# Altium schematic sheet 03-WIFI.SchDoc
size A4
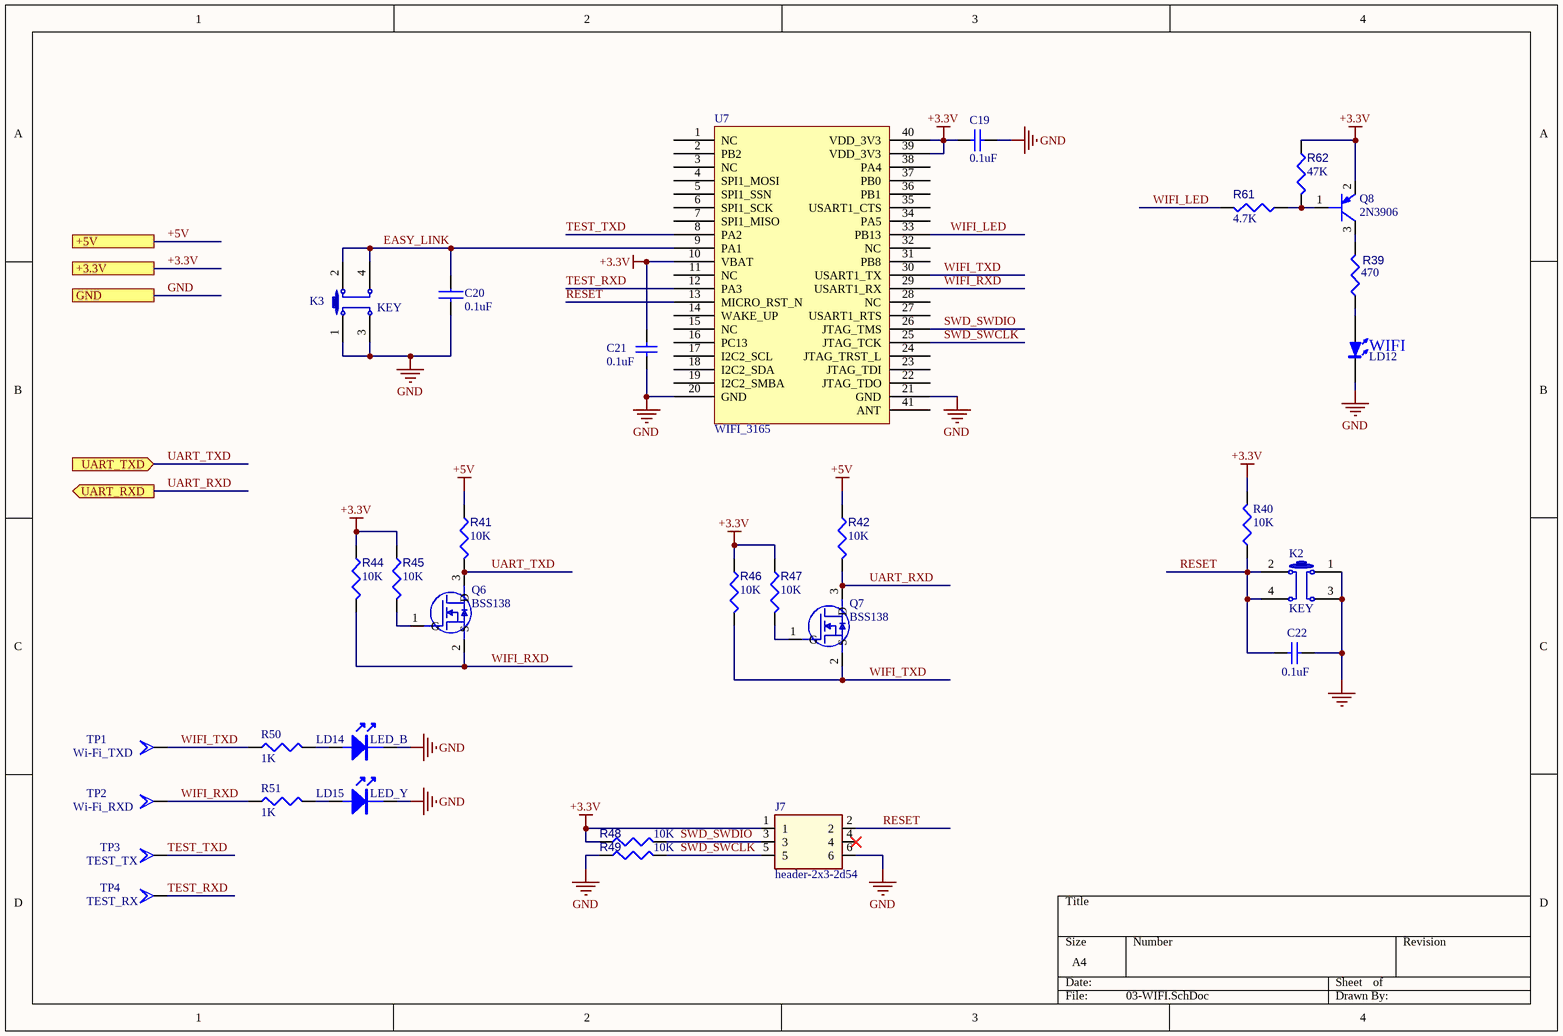
[diagram p0: 03-WIFI.SchDoc]

## Parts
C19  0.1uF  [0805_C]
C20  0.1uF  [0805_C]
C21  0.1uF  [0805_C]
C22  0.1uF  [0805_C]
J7  header-2x3-2d54  [HT8550_FLASH_LOADER]
K2  KEY  [KEY_SMD5465]
K3  KEY  [KEY_SMD5465]
LD12  WHITE  [LED1]  (value not drawn)
LD14  LED_B  [LED_0805]
LD15  LED_Y  [LED_0805]
Q6  BSS138  [SOT23]
Q7  BSS138  [SOT23]
Q8  2N3906  [SOT23]
R39  470  [0805_R]
R40  10K  [0805_R]
R41  10K  [0805_R]
R42  10K  [0805_R]
R44  10K  [0805_R]
R45  10K  [0805_R]
R46  10K  [0805_R]
R47  10K  [0805_R]
R48  10K  [0805_R]
R49  10K  [0805_R]
R50  1K  [0805_R]
R51  1K  [0805_R]
R61  4.7K  [0805_R]
R62  47K  [0805_R]
TP1  Wi-Fi_TXD  [TP_60_30]
TP2  Wi-Fi_RXD  [TP_60_30]
TP3  TEST_TX  [TP_60_30]
TP4  TEST_RX  [TP_60_30]
U7  WIFI_3165  [EMW3165-P]

## Ports
+3.3V, +5V, GND, UART_RXD (out), UART_TXD (in)

## Nets
+3.3V: C19.2 C21.2 J7.1 Q8.2(EMITTER) R40.2 R44.1 R45.1 R46.1 R47.1 R48.1 R62.1 U7.10(VBAT) U7.39(VDD_3V3) U7.40(VDD_3V3) ; port +3.3V
+5V: R41.1 R42.1 ; port +5V
GND: C19.1 C20.2 C21.1 C22.1 J7.6 K2.1 K2.3 K3.1 K3.3 LD12.K LD14.K LD15.K R49.1 U7.20(GND) U7.21(GND) ; port GND
EASY_LINK: C20.1 K3.2 K3.4 U7.9(PA1)
RESET: C22.2 J7.2 K2.2 K2.4 R40.1 U7.13(MICRO_RST_N)
SWD_SWCLK: J7.5 R49.2 U7.25(JTAG_TCK)
SWD_SWDIO: J7.3 R48.2 U7.26(JTAG_TMS)
TEST_RXD: TP4.1(TP) U7.12(PA3)
TEST_TXD: TP3.1(TP) U7.8(PA2)
UART_RXD: Q7.3(D) R42.2 ; port UART_RXD
UART_TXD: Q6.3(D) R41.2 ; port UART_TXD
WIFI_LED: R61.2 U7.33(PB13)
WIFI_RXD: Q6.2(S) R44.2 R51.1 TP2.1(TP) U7.29(USART1_RX)
WIFI_TXD: Q7.2(S) R46.2 R50.1 TP1.1(TP) U7.30(USART1_TX)
NetLD12_A: LD12.A R39.1
NetLD14_A: LD14.A R50.2
NetLD15_A: LD15.A R51.2
NetQ6_1: Q6.1(G) R45.2
NetQ7_1: Q7.1(G) R47.2
NetQ8_1: Q8.1(BASE) R61.1 R62.2
NetQ8_3: Q8.3(COLLECTOR) R39.2

Not connected (* = marked no-connect by the designer): J7 4*; U7 1(NC) 2(PB2) 3(NC) 4(SPI1_MOSI) 5(SPI1_SSN) 6(SPI1_SCK) 7(SPI1_MISO) 11(NC) 14(WAKE_UP) 15(NC) 16(PC13) 17(I2C2_SCL) 18(I2C2_SDA) 19(I2C2_SMBA) 22(JTAG_TDO) 23(JTAG_TDI) 24(JTAG_TRST_L) 27(USART1_RTS) 28(NC) 31(PB8) 32(NC) 34(PA5) 35(USART1_CTS) 36(PB1) 37(PB0) 38(PA4) 41(ANT)

## Notes on the sheet
- (near LD12) WIFI

## Library data of the parts
C19 C21 = Cap Semi_1: Capacitor; Published: 8-Jun-2000; LatestRevisionDate: 29-May-2009; LatestRevisionNote: IPC-7351 Footprint Added.; PackageReference: C1206; Publisher: Altium Limited; PackageDescription: Chip Capacitor
C20 = CAP NP
C22 = Cap: Capacitor; Published: 8-Jun-2000; LatestRevisionDate: 17-Jul-2002; LatestRevisionNote: Re-released for DXP Platform.; PackageReference: RAD-0.3; Publisher: Altium Limited; Value: 0.1UF
LD12 LD14 LD15 = LED
Q6 Q7 = N-Channel Enhancement MOSFET
Q8 = PNP
R39 R40 R48 R49 R61 R62 = Res3: Resistor; Published: 8-Jun-2000; PackageReference: J1-0603; Publisher: Altium Limited
  R39 R48 R49 R61 R62: LatestRevisionDate: 29-May-2009; LatestRevisionNote: IPC-7351 Footprint Added.; PackageDescription: Chip Resistor
  R40: LatestRevisionDate: 04-Mar-2005; LatestRevisionNote: PCB Footprint replaced.; Value: 10K
R41 R42 R44-R47 = Res3_3: Resistor; Published: 8-Jun-2000; LatestRevisionDate: 29-May-2009; LatestRevisionNote: IPC-7351 Footprint Added.; PackageReference: J1-0603; Publisher: Altium Limited; PackageDescription: Chip Resistor
R50 R51 = R
TP1-TP4 = T POINT A